# EAGLE schematic HGS_Reflector (EAGLE 9.4.2)
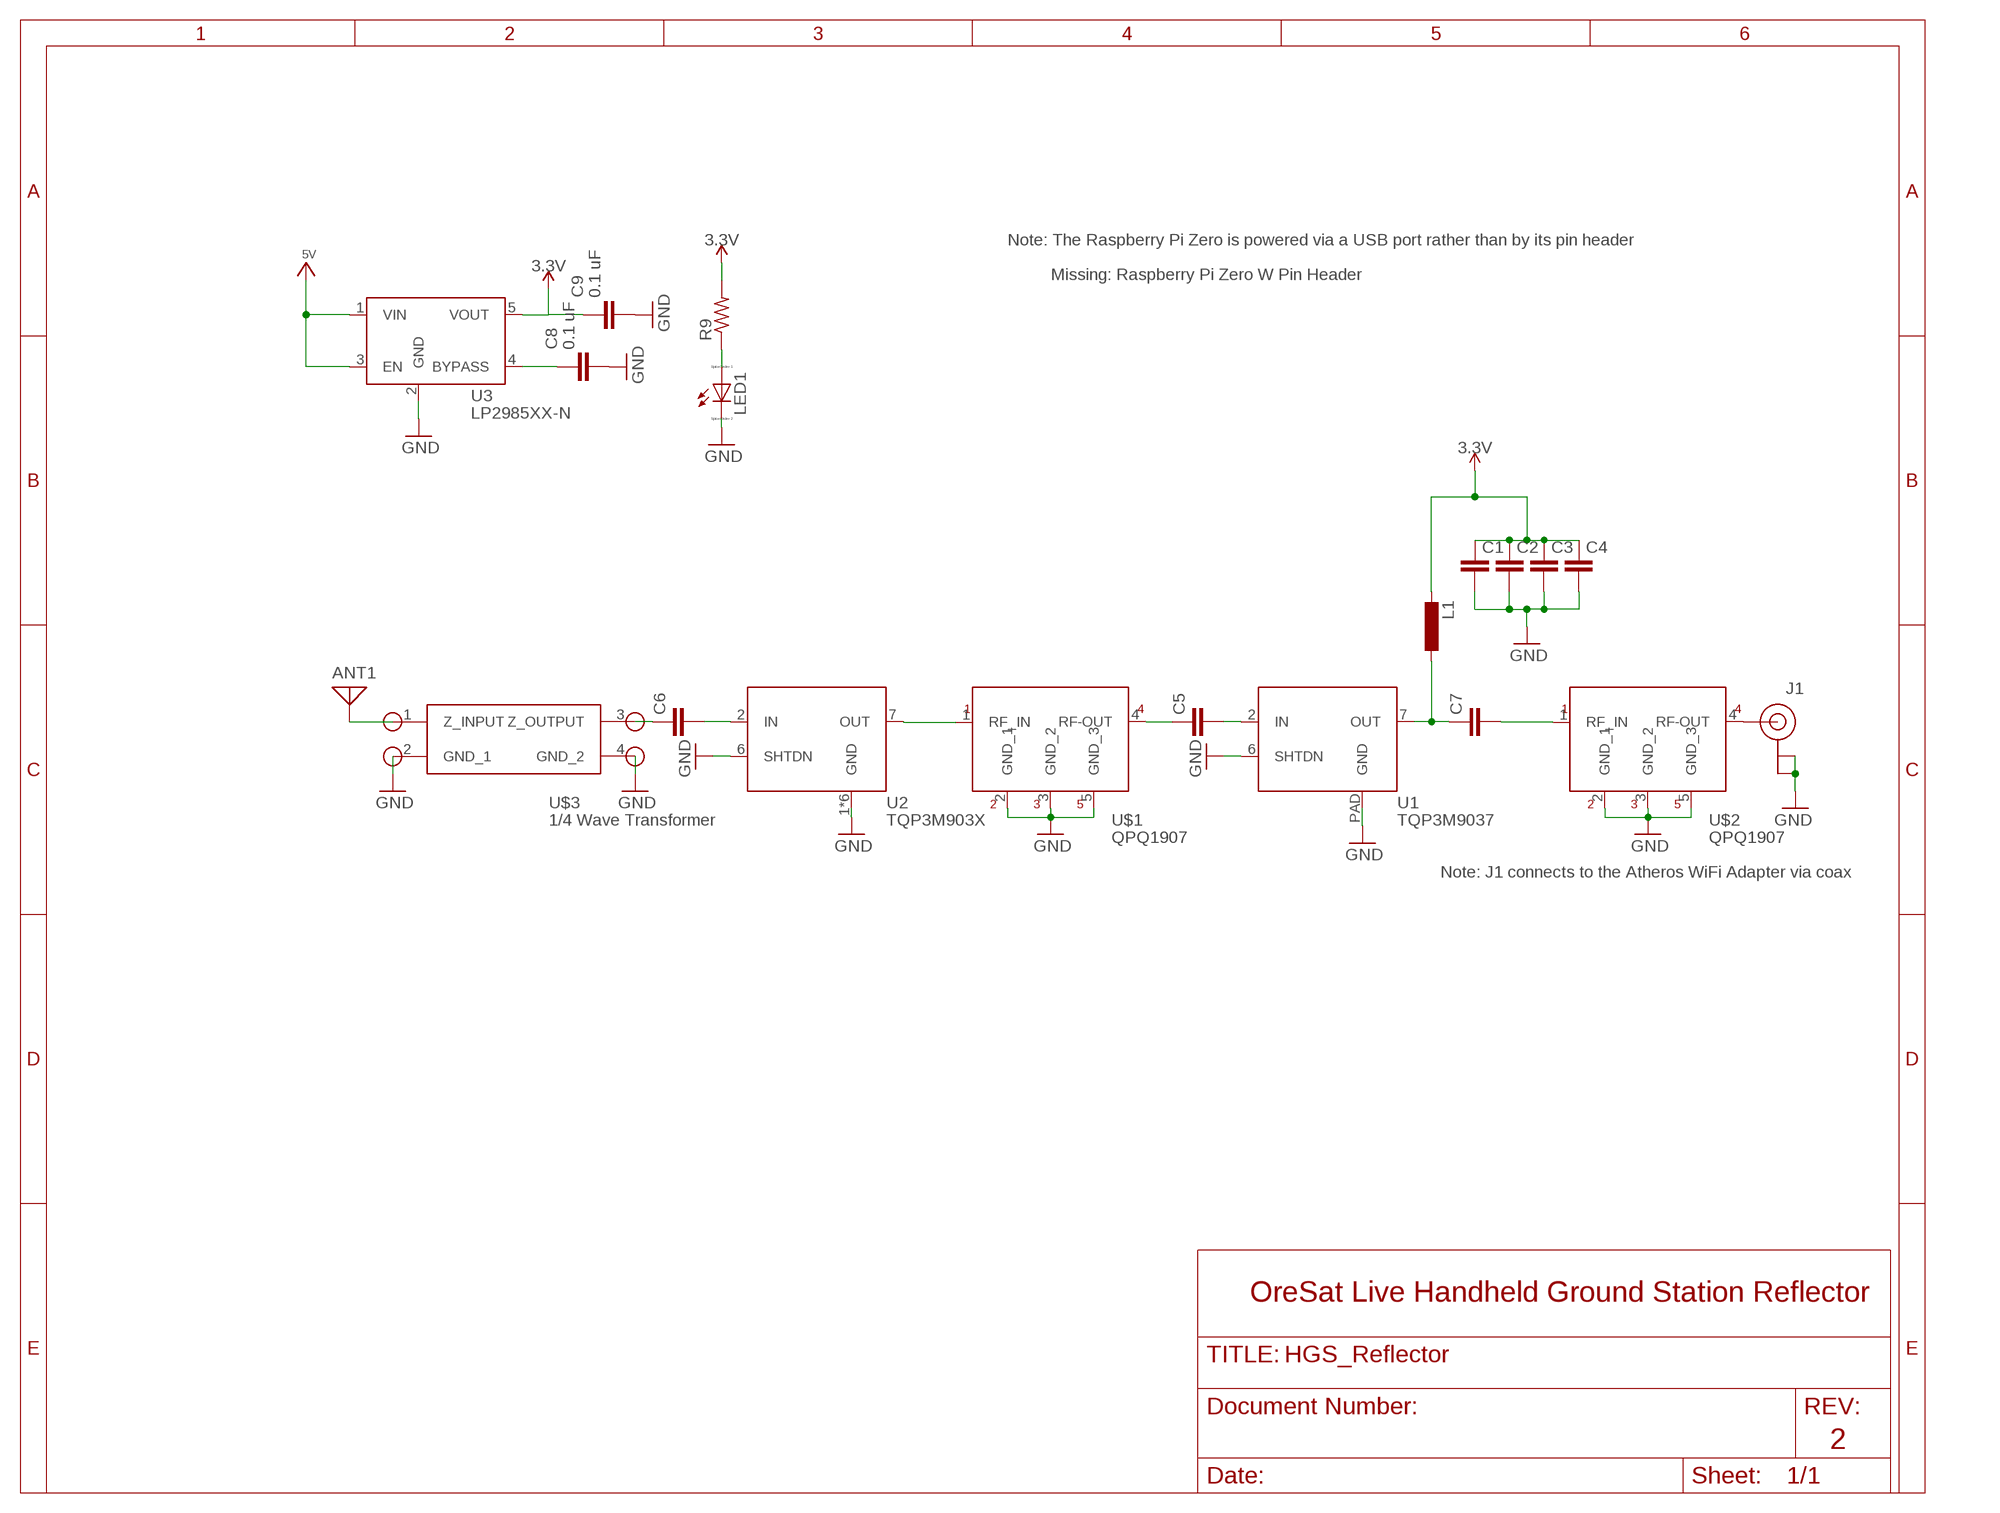
[diagram p0: schematic, sheet 1]

## Parts
ANT1  ANTENNA  [PAD-01]
C1  C-EU0603-C-NOSILK  [.0603-C-NOSILK]
C2  C-EU0603-C-NOSILK  [.0603-C-NOSILK]
C3  C-EU0603-C-NOSILK  [.0603-C-NOSILK]
C4  C-EU0603-C-NOSILK  [.0603-C-NOSILK]
C5  C-EU0402-C-NOSILK  [.0402-C-NOSILK]
C6  C-EU0402-C-NOSILK  [.0402-C-NOSILK]
C7  C-EU0402-C-NOSILK  [.0402-C-NOSILK]
C8  0.1 uF  C  (no package)
C9  0.1 uF  C  (no package)
J1  U.FL  [U.FL]
L1  L-EUL3216C  [L3216C]
LED1  LED_E  [LED_1206]
R9  R-US_0603-C-NOSILK  [.0603-C-NOSILK]
U1  TQP3M9037  [DFN8-2X2-WITH-PAD]
U2  TQP3M903X  [DFN8-2X2-WITH-PAD]
U3  LP2985XX-N  [SOT-23]
U$1  BPFQPQ1907  [QPQ1907]
U$2  BPFQPQ1907  [QPQ1907]
U$3  1/4_WAVE_TRF  [1/4_WAVE_TRF]

## Nets
3.3V: C1.1 C2.1 C3.1 C4.1 L1.2 R9.2
5V: U3.1(VIN) U3.3(EN)
GND: C1.2 C2.2 C3.2 C4.2 C8.2 C9.2 J1.1(GND) J1.2(GND) LED1.C U1.6(SHTDN) U1.PAD(GND) U2.1(GND) U2.3(GND) U2.4(GND) U2.5(GND) U2.6(SHTDN) U2.8(GND) U2.PAD(GND) U3.2(GND) U$1.2(GND_1) U$1.3(GND_2) U$1.5(GND_3) U$2.2(GND_1) U$2.3(GND_2) U$2.5(GND_3) U$3.2(GND_1)
N$1: C5.2 U1.2(IN)
N$2: U2.7(OUT) U$1.1(RF_IN)
N$3: C5.1 U$1.4(RF-OUT)
N$4: C7.2
N$5: C7.1 L1.1 U1.7(OUT)
N$6: J1.FEED(SIGNAL) U$2.4(RF-OUT)
N$7: C6.1 U$3.3(Z_OUTPUT)
N$8: C6.2 U2.2(IN)
N$9: U$3.4(GND_2) ; supply symbol labelled GND
N$10: LED1.A R9.1
N$11: ANT1.1 U$3.1(Z_INPUT)
N$12: C8.1 U3.4(BYPASS)
N$13: C9.1 U3.5(VOUT) ; supply symbol labelled 3.3V
Unconnected: U$2.1(RF_IN)

## Notes on the sheet
- Note: The Raspberry Pi Zero is powered via a USB port rather than by its pin header
- Missing: Raspberry Pi Zero W Pin Header
- Note: J1 connects to the Atheros WiFi Adapter via coax
- OreSat Live Handheld Ground Station Reflector
- 2

## Library data of the parts
ANT1 = discrete:ANTENNA: Antenna
C1-C7 = oresat-rcl:C-EU: CAPACITOR, European symbol
C8 C9 = ngspice-simulation:C: CAPACITOR
J1 = SparkFun-Connectors:U.FL: SMD Antenna Connector - U.FL 2mm height, 3.0mm x 3.0mm receptacle size. SparkFun Products: SparkFun WiFi Shield - ESP8266 <https://www.sparkfun.com/products/13287> SparkFun ESP8266 Thing <https://www.sparkfun.com/products/13231> SparkFun MiniGen - Pro Mini Signal Generator Shield <https://www.sparkfun.com/products/11420>; PROD_ID: CONN-09193; SF_ID: WRL-09144
L1 = rcl:L-EU: INDUCTOR, European symbol; SPICEPREFIX: L
LED1 = eagle-ltspice:LED_E: LED Source: http://www.osram.convergy.de Source: www.luxeon.com Source: www.kingbright.com; SPICEMODEL: NONE; SPICEPREFIX: D; SPICETYPE: diode
R9 = oresat-rcl:R-US_: RESISTOR, American symbol
U1 = U-Qorvo-TQP3M9037-LNA:TQP3M9037: Ultra Low Noise, High Linearity LNA 0.7 - 6.0 GHz Operational Bandwidth Source: Datasheet <https://www.qorvo.com/products/p/TQP3M9037>
U2 = U-Qorvo-TQP3M903x-LNA:TQP3M903X: Ultra Low Noise, High Linearity LNAs TQP3M9035: 0.05 - 6.0 GHz Operational Bandwidth Source: Datasheet <https://www.qorvo.com/products/p/TQP3M9035> TQP3M9036: 0.1 - 2.0 GHz Operational Bandwidth Source: Datasheet <https://www.qorvo.com/products/p/TQP3M9036> TQP3M9037: 0.7 - 6.0 GHz Operational Bandwidth Source: Datasheet <https://www.qorvo.com/products/p/TQP3M9037>
U3 = U-TI-LP2985XX-N-linear-reg:LP2985XX-N: TI 150mA Low Noise LDO Regulators LP2985-N (various fixed >2.0V) Source: Datasheet <http://www.ti.com/product/LP2985-N?qgpn=lp2985-n> LP2985LV-N (1.5, 1.8, 2.0V fixed) Source: Datasheet <http://www.ti.com/product/LP2985LV-N?qgpn=lp2985lv-n>
U$1 U$2 = HGS_Data_Parts:BPF
U$3 = HGS_Data_Parts:1/4_WAVE_TRF